# Altium schematic sheet [2] BLOCK DIAGRAM.SchDoc
size Letter; Author: Ángel O. , Victor V.; DocumentNumber: 2; Revision: 1.0; SheetNumber: 2; SheetTotal: 6
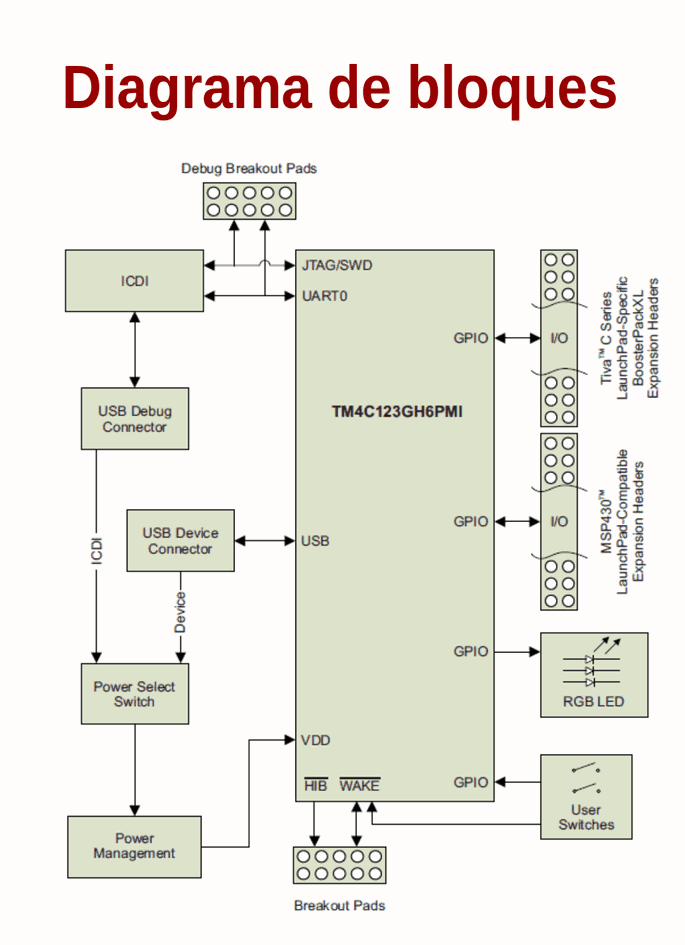
[diagram p0: [2] BLOCK DIAGRAM.SchDoc]

## Notes on the sheet
- Diagrama de bloques
- Project:
- Page Content:
- Revisión:
- Size:
- Letter
- Design:
- Document Number:
- Date:
- Sheet:
- of